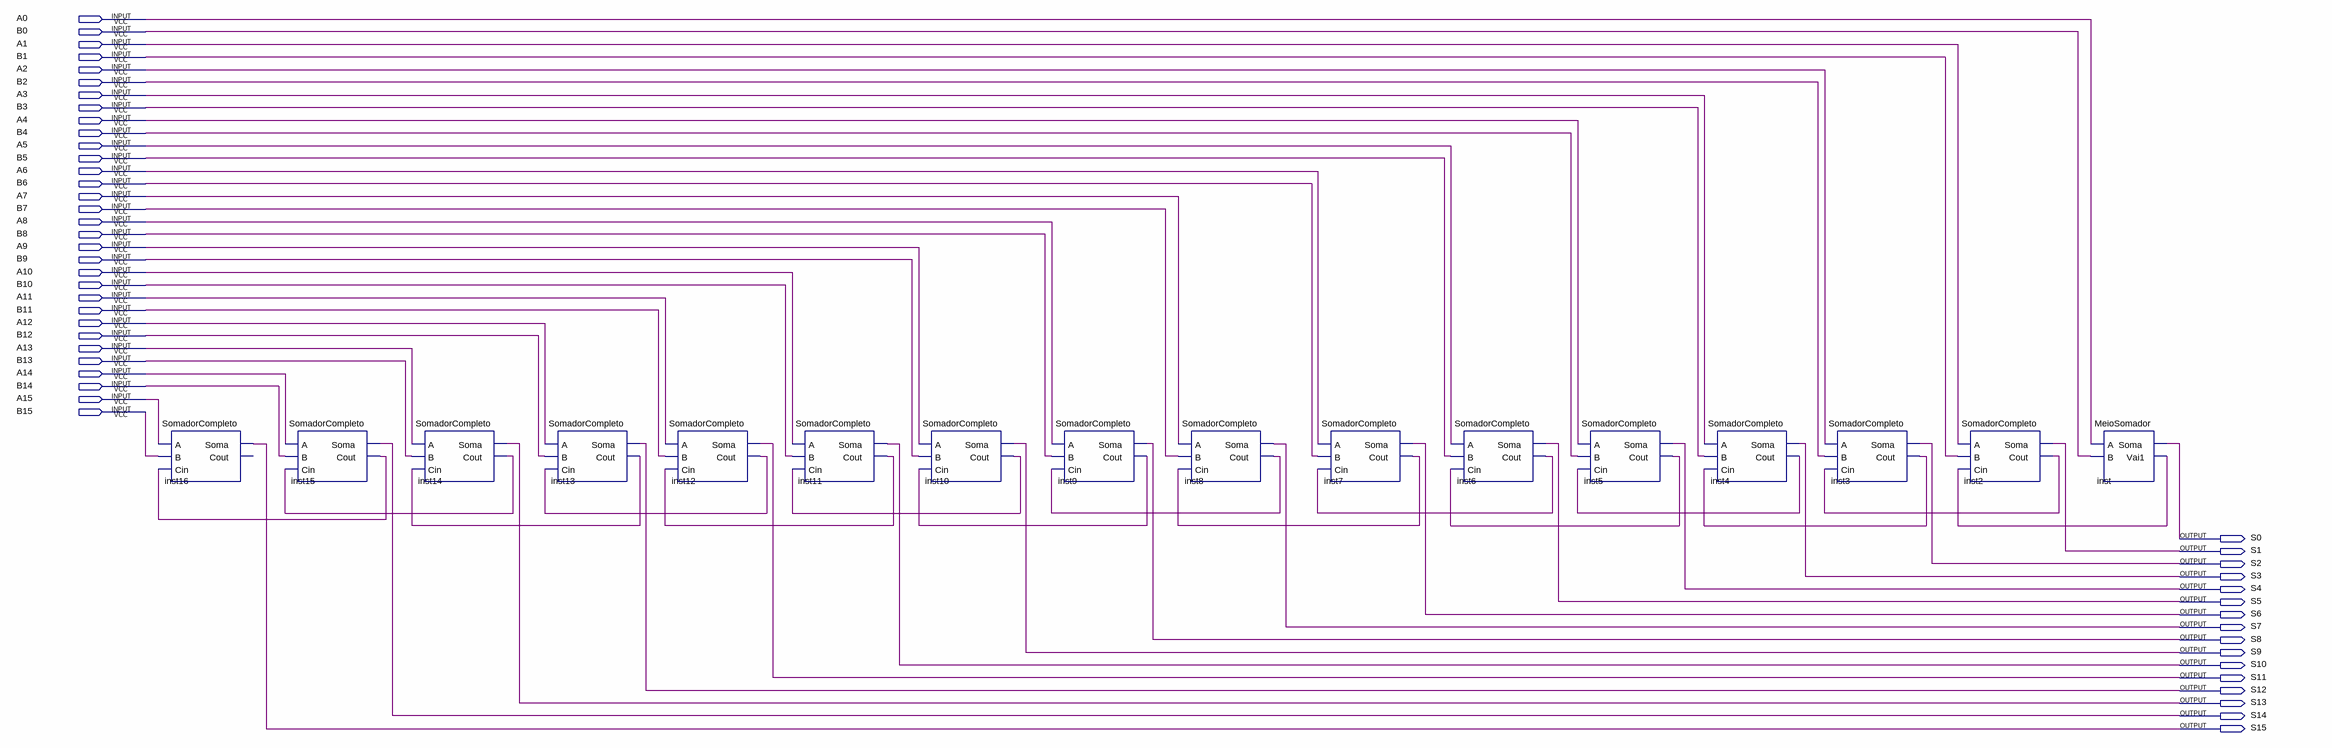
[diagram p0: schematic sheet]
// Quartus schematic Somador16B.bdf as structural Verilog: 16 symbols, 48 pins
module Somador16B (
  input  A0,
  input  B0,
  input  A1,
  input  B1,
  input  A2,
  input  B2,
  input  A3,
  input  B3,
  input  A4,
  input  B4,
  input  A5,
  input  B5,
  input  A6,
  input  B6,
  input  A7,
  input  B7,
  input  A8,
  input  B8,
  input  A9,
  input  B9,
  input  A10,
  input  B10,
  input  A11,
  input  B11,
  input  A12,
  input  B12,
  input  A13,
  input  B13,
  input  A14,
  input  B14,
  input  A15,
  input  B15,
  output S0,
  output S1,
  output S2,
  output S3,
  output S4,
  output S5,
  output S6,
  output S7,
  output S8,
  output S9,
  output S10,
  output S11,
  output S12,
  output S13,
  output S14,
  output S15
);

  wire inst2_cout, inst3_cout, inst4_cout, inst5_cout, inst6_cout, inst7_cout, inst8_cout, inst9_cout,
       inst10_cout, inst11_cout, inst12_cout, inst13_cout, inst14_cout, inst15_cout, inst_vai1;

  SomadorCompleto inst16 (.A(A15), .B(B15), .Cin(inst15_cout), .Soma(S15));  // open: Cout
  SomadorCompleto inst15 (.A(A14), .B(B14), .Cin(inst14_cout), .Soma(S14), .Cout(inst15_cout));
  SomadorCompleto inst14 (.A(A13), .B(B13), .Cin(inst13_cout), .Soma(S13), .Cout(inst14_cout));
  SomadorCompleto inst13 (.A(A12), .B(B12), .Cin(inst12_cout), .Soma(S12), .Cout(inst13_cout));
  SomadorCompleto inst12 (.A(A11), .B(B11), .Cin(inst11_cout), .Soma(S11), .Cout(inst12_cout));
  SomadorCompleto inst11 (.A(A10), .B(B10), .Cin(inst10_cout), .Soma(S10), .Cout(inst11_cout));
  SomadorCompleto inst10 (.A(A9), .B(B9), .Cin(inst9_cout), .Soma(S9), .Cout(inst10_cout));
  SomadorCompleto inst9 (.A(A8), .B(B8), .Cin(inst8_cout), .Soma(S8), .Cout(inst9_cout));
  SomadorCompleto inst8 (.A(A7), .B(B7), .Cin(inst7_cout), .Soma(S7), .Cout(inst8_cout));
  SomadorCompleto inst7 (.A(A6), .B(B6), .Cin(inst6_cout), .Soma(S6), .Cout(inst7_cout));
  SomadorCompleto inst6 (.A(A5), .B(B5), .Cin(inst5_cout), .Soma(S5), .Cout(inst6_cout));
  SomadorCompleto inst5 (.A(A4), .B(B4), .Cin(inst4_cout), .Soma(S4), .Cout(inst5_cout));
  SomadorCompleto inst4 (.A(A3), .B(B3), .Cin(inst3_cout), .Soma(S3), .Cout(inst4_cout));
  SomadorCompleto inst3 (.A(A2), .B(B2), .Cin(inst2_cout), .Soma(S2), .Cout(inst3_cout));
  SomadorCompleto inst2 (.A(A1), .B(B1), .Cin(inst_vai1), .Soma(S1), .Cout(inst2_cout));
  MeioSomador inst (.A(A0), .B(B0), .Soma(S0), .Vai1(inst_vai1));
endmodule
